# Altium schematic sheet switches.SchDoc
size A4; SheetNumber: 1; SheetTotal: 1
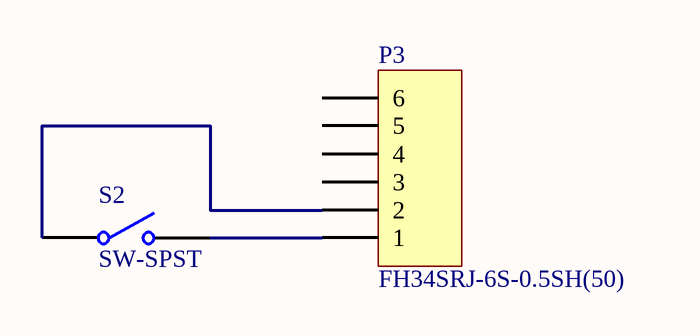
[diagram p0: switches.SchDoc]

## Parts
P3  FH34SRJ-6S-0.5SH(50)  [HRS_FH34SRJ-6S-0.5SH(50)]
S2  SW-SPST  [ESE22MH24]

## Nets
NetP3_1: P3.1 S2.2(NO)
NetP3_2: P3.2 S2.1(COMMON)

Not connected (* = marked no-connect by the designer): P3 3 4 5 6

## Library data of the parts
P3 = Header 6: Header, 6-Pin; MYPN: J-FH34SRJ-6S-0.5SH(50); VENDOR: HRS; LatestRevisionDate: 17-Jul-2002; LatestRevisionNote: Re-released for DXP Platform.; Publisher: Altium Limited; MPN: FH34SRJ-6S-0.5SH(50)
S2 = SW-SPST: Single-Pole, Single-Throw Switch; MFG: Panasonic; Published: 24-Mar-1999; LatestRevisionDate: 17-Jul-2002; LatestRevisionNote: Re-released for DXP Platform.; PackageReference: SPST-2; Publisher: Altium Limited; MPN: ESE22MH24